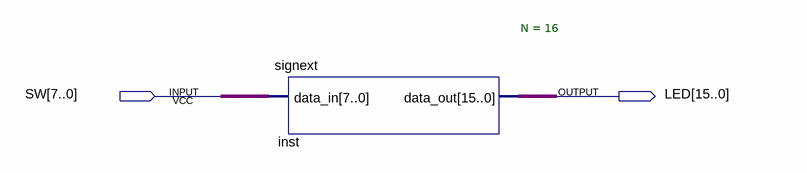
[diagram p0: schematic sheet]
// Quartus schematic test_signext.bdf as structural Verilog: 1 symbols, 2 pins
module test_signext (
  input  [7:0] SW,
  output [15:0] LED
);

  signext #(.N(16)) inst (.data_in(SW), .data_out(LED));
endmodule
